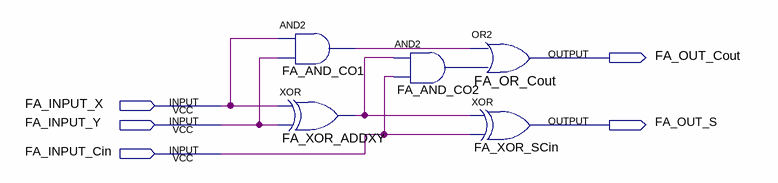
[diagram p0: schematic sheet]
// Quartus schematic full_adder.bdf as structural Verilog: 5 symbols, 5 pins
module full_adder (
  input  FA_INPUT_X,
  input  FA_INPUT_Y,
  input  FA_INPUT_Cin,
  output FA_OUT_Cout,
  output FA_OUT_S
);

  wire FA_AND_CO1_out, FA_AND_CO2_out, FA_XOR_ADDXY_out;

  and FA_AND_CO1 (FA_AND_CO1_out, FA_INPUT_X, FA_INPUT_Y);
  xor FA_XOR_ADDXY (FA_XOR_ADDXY_out, FA_INPUT_X, FA_INPUT_Y);
  and FA_AND_CO2 (FA_AND_CO2_out, FA_XOR_ADDXY_out, FA_INPUT_Cin);
  or FA_OR_Cout (FA_OUT_Cout, FA_AND_CO1_out, FA_AND_CO2_out);
  xor FA_XOR_SCin (FA_OUT_S, FA_XOR_ADDXY_out, FA_INPUT_Cin);
endmodule
